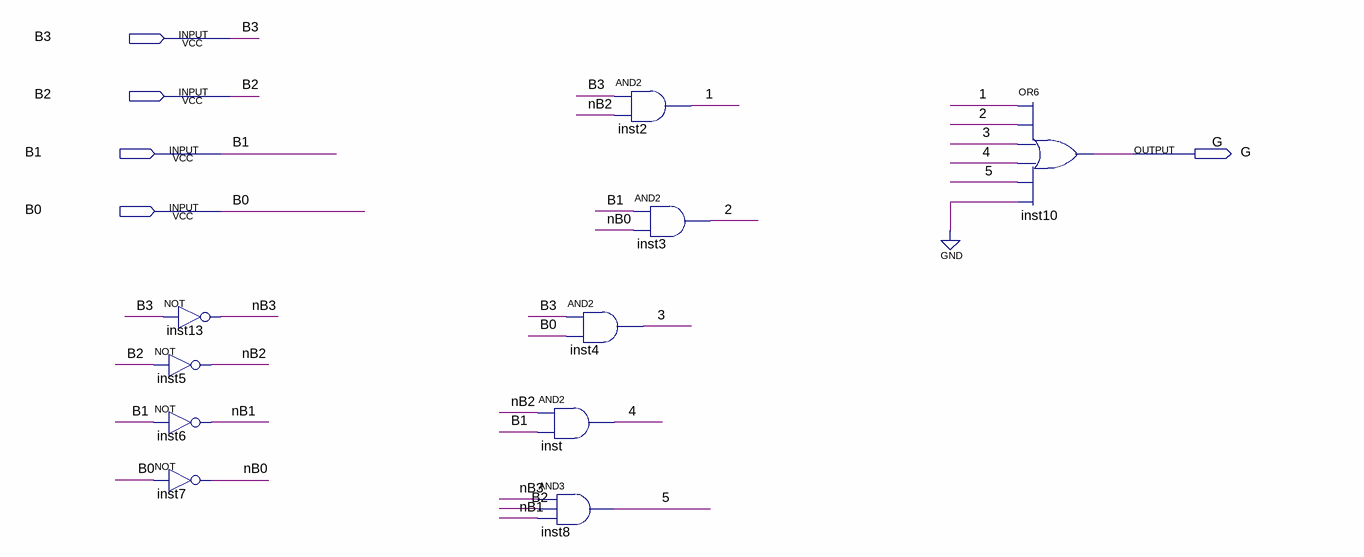
[diagram p0: schematic sheet]
// Quartus schematic G.bdf as structural Verilog: 10 symbols, 5 pins
module G (
  input  B3,
  input  B2,
  input  B1,
  input  B0,
  output G
);

  wire \1 , \2 , \3 , \4 , \5 , nB0, nB1, nB2, nB3;

  not inst13 (nB3, B3);
  not inst5 (nB2, B2);
  not inst6 (nB1, B1);
  not inst7 (nB0, B0);
  and inst (\4 , nB2, B1);
  and inst8 (\5 , nB3, B2, nB1);
  and inst2 (\1 , B3, nB2);
  and inst3 (\2 , B1, nB0);
  and inst4 (\3 , B3, B0);
  or inst10 (G, \1 , \2 , \3 , \4 , \5 , 1'b0);
endmodule
